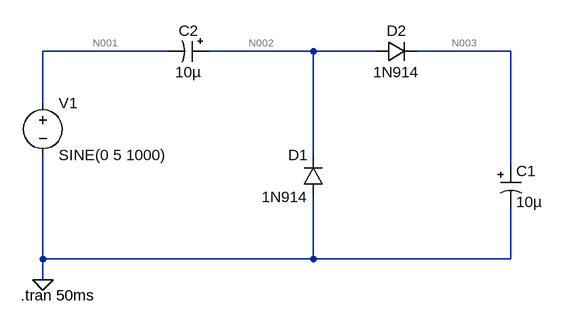
[diagram p0: schematic project.asc]
project.asc, the LTspice schematic file:
Version 4
SHEET 1 880 680
WIRE 272 -112 80 -112
WIRE 496 -112 336 -112
WIRE 592 -112 496 -112
WIRE 800 -112 656 -112
WIRE 80 -32 80 -112
WIRE 496 48 496 -112
WIRE 800 64 800 -112
WIRE 80 208 80 48
WIRE 496 208 496 112
WIRE 496 208 80 208
WIRE 800 208 800 128
WIRE 800 208 496 208
WIRE 80 240 80 208
FLAG 80 240 0
SYMBOL voltage 80 -48 R0
WINDOW 123 0 0 Left 2
WINDOW 39 0 0 Left 2
SYMATTR InstName V1
SYMATTR Value SINE(0 5 1000)
SYMBOL polcap 784 64 R0
SYMATTR InstName C1
SYMATTR Value 10µ
SYMBOL diode 512 112 R180
WINDOW 0 24 64 Left 2
WINDOW 3 24 0 Left 2
SYMATTR InstName D1
SYMATTR Value 1N914
SYMBOL diode 592 -96 R270
WINDOW 0 32 32 VTop 2
WINDOW 3 0 32 VBottom 2
SYMATTR InstName D2
SYMATTR Value 1N914
SYMBOL polcap 336 -128 R90
WINDOW 0 0 32 VBottom 2
WINDOW 3 32 32 VTop 2
SYMATTR InstName C2
SYMATTR Value 10µ
TEXT 46 264 Left 2 !.tran 50ms

The netlist it stands for:
* project.asc
V1 N001 0 SINE(0 5 1000)
C1 N003 0 10µ
D1 0 N002 1N914
D2 N002 N003 1N914
C2 N002 N001 10µ
.model D D
.lib standard.dio
.tran 50ms
.backanno
.end

* Results of the author's LTspice run, read from the files saved beside the schematic
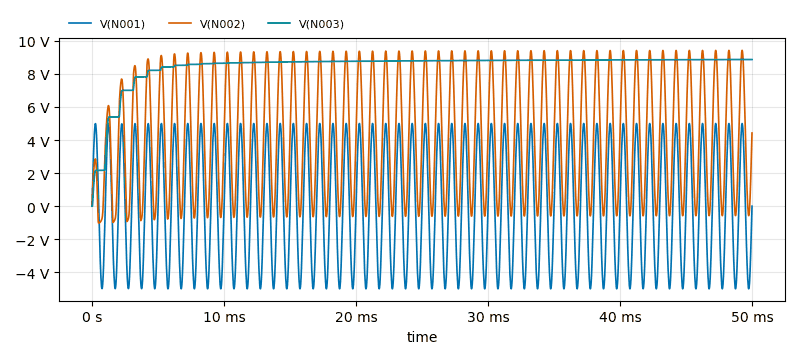
[diagram p1: Transient Analysis of project.asc, plotted from the saved traces]
* Transient Analysis, 1 run:
*   V(N001): min -4.998 V, max 4.998 V, average -294.1 µV, rms 3.518 V, last 0 V
*   V(N002): min -1.022 V, max 9.421 V, average 4.23 V, rms 5.498 V, last 4.426 V
*   V(N003): min 0 V, max 8.867 V, average 8.484 V, rms 8.558 V, last 8.867 V